# EAGLE schematic Schematic (EAGLE 7.1.0)
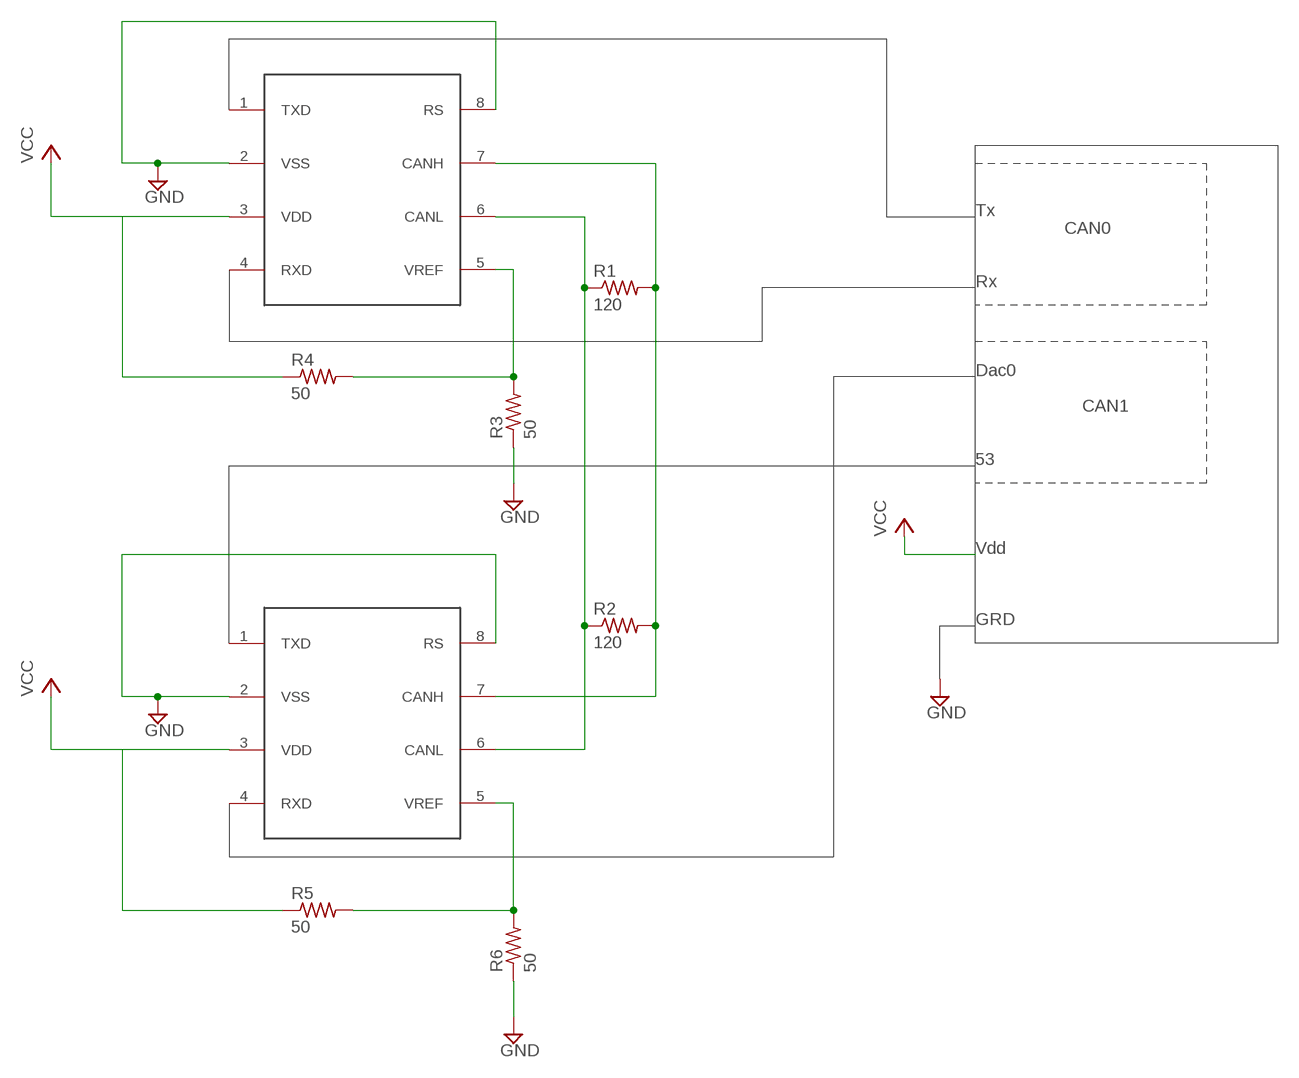
[diagram p0: schematic, sheet 1]

## Parts
R1  120  RESISTOR  [R0805]
R2  120  RESISTOR  [R0805]
R3  50  RESISTOR  [R0805]
R4  50  RESISTOR  [R0805]
R5  50  RESISTOR  [R0805]
R6  50  RESISTOR  [R0805]
U$1  MCP2551  [SOIC8]
U$4  MCP2551  [SOIC8]

## Nets
GND: R3.1 R6.1 U$1.2(VSS) U$1.8(RS) U$4.2(VSS) U$4.8(RS)
N$3: R3.2 R4.2 U$1.5(VREF)
N$4: R1.2 R2.2 U$1.7(CANH) U$4.7(CANH)
N$7: R5.2 R6.2 U$4.5(VREF)
N$8: R1.1 R2.1 U$1.6(CANL) U$4.6(CANL)
VCC: R4.1 R5.1 U$1.3(VDD) U$4.3(VDD)
Unconnected: U$1.1(TXD) U$1.4(RXD) U$4.1(TXD) U$4.4(RXD)

## Notes on the sheet
- Tx
- CAN0
- Rx
- Dac0
- CAN1
- 53
- Vdd
- GRD

## Library data of the parts
R1-R6 = Dash parts:RESISTOR
U$1 U$4 = Dash parts:MCP2551